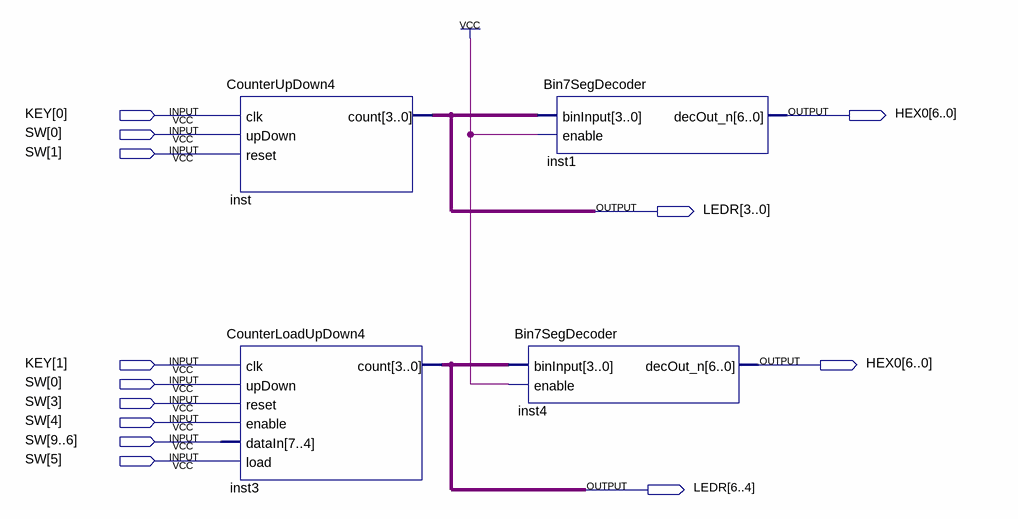
[diagram p0: schematic sheet]
// Quartus schematic Counter_Demo.bdf as structural Verilog: 4 symbols, 13 pins
module Counter_Demo (
  input  [1:0] KEY,
  input  [9:0] SW,
  output [6:0] HEX0,
  output [6:0] LEDR
);

  CounterUpDown4 inst (.clk(KEY[0]), .upDown(SW[0]), .reset(SW[1]), .count(LEDR[3:0]));
  CounterLoadUpDown4 inst3 (
    .clk(KEY[1]), .upDown(SW[0]), .reset(SW[3]), .enable(SW[4]), .dataIn(SW[9:6]), .load(SW[5]),
    .count(LEDR[6:4]));
  Bin7SegDecoder inst4 (.binInput(LEDR[6:4]), .enable(1'b1), .decOut_n(HEX0));
  Bin7SegDecoder inst1 (.binInput(LEDR[3:0]), .enable(1'b1), .decOut_n(HEX0));
endmodule
